# EAGLE design motor4 (EAGLE 6.1)

## Sheet 1 of 3
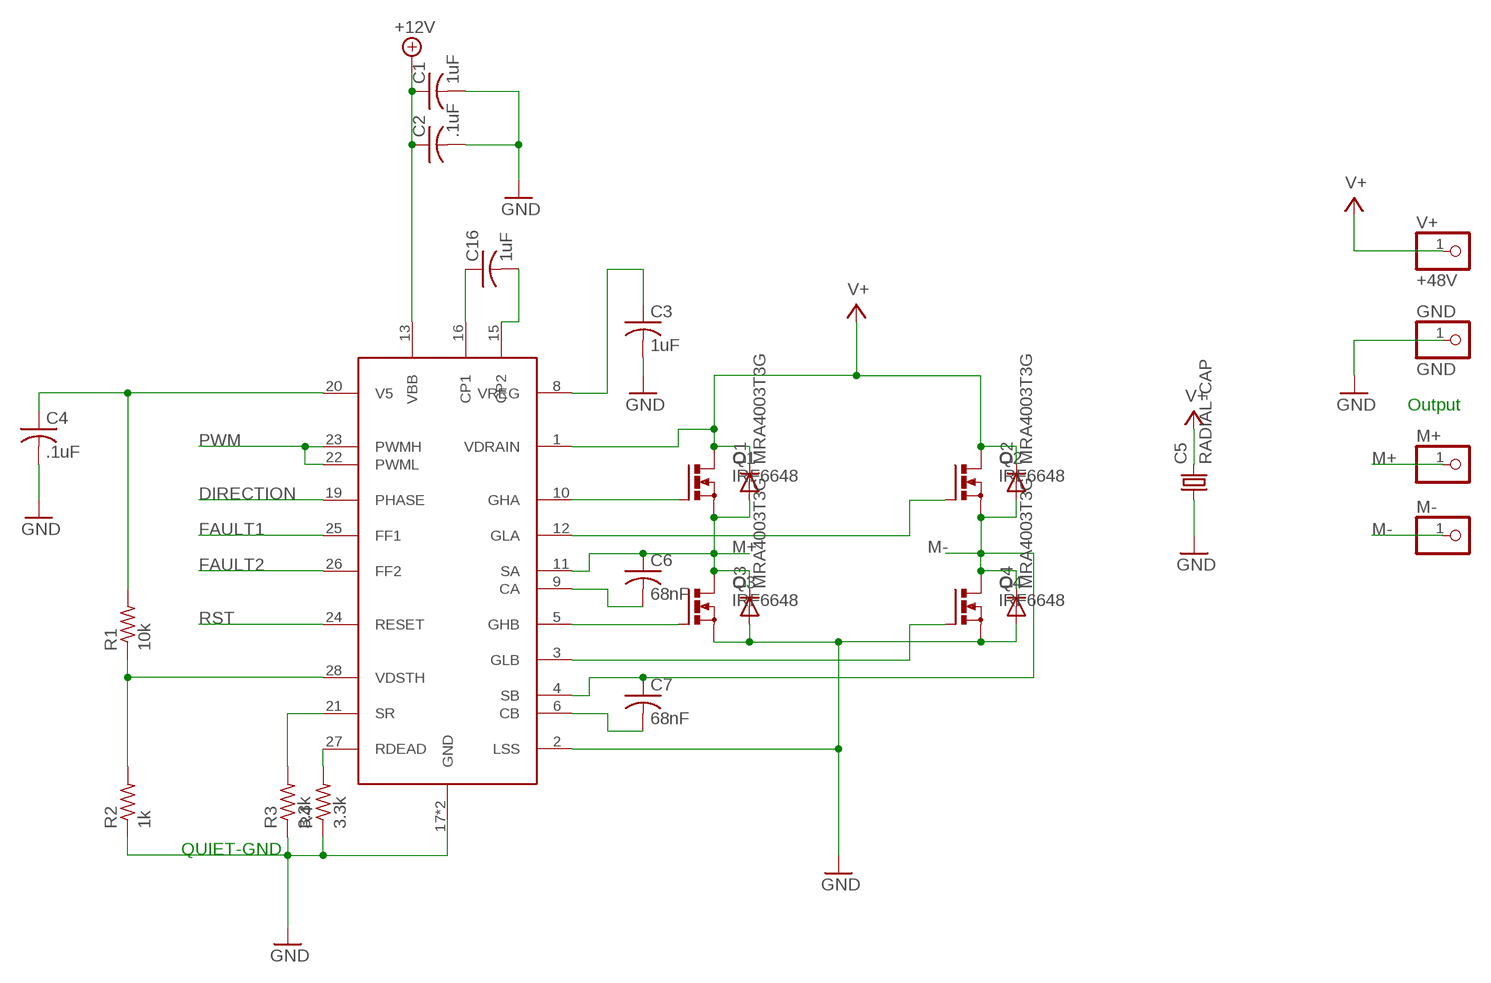
[diagram p0: schematic, sheet 1]

### Parts
ALLGR  ALLEGRO-A3921  [TSSOP28]
C1  1uF  C-USC0603  [C0603]
C2  .1uF  C-USC0603  [C0603]
C3  1uF  C-USC0603  [C0603]
C4  .1uF  C-USC0603  [C0603]
C5  RADIAL-CAP  [RADIAL-CAP]
C6  68nF  C-USC0603  [C0603]
C7  68nF  C-USC0603  [C0603]
C16  1uF  C-USC0603  [C0603]
D1  MRA4003T3G  [SMA]
D2  MRA4003T3G  [SMA]
D3  MRA4003T3G  [SMA]
D4  MRA4003T3G  [SMA]
GND  GND  PINHD-1X1  [1X01]
M+  PINHD-1X1  [1X01]
M-  PINHD-1X1  [1X01]
Q1  IRF6648  [DIRECTFET]
Q2  IRF6648  [DIRECTFET]
Q3  IRF6648  [DIRECTFET]
Q4  IRF6648  [DIRECTFET]
R1  10k  R-US_R0603  [R0603]
R2  1k  R-US_R0603  [R0603]
R3  3.3k  R-US_R0603  [R0603]
R4  3.3k  R-US_R0603  [R0603]
V+  +48V  PINHD-1X1  [1X01]

### Nets
+5V-A: ALLGR.20(V5) C4.1 R1.2
+12V: ALLGR.13(VBB) C1.1 C2.1 ; also sheet 3
+48V: ALLGR.1(VDRAIN) C5.P$1 D1.C D2.C Q1.D@1(D) Q1.D@2(D) Q1.D@3(D) Q1.D@4(D) Q2.D@1(D) Q2.D@2(D) Q2.D@3(D) Q2.D@4(D) V+.1 ; supply symbol labelled V+ ; also sheet 3
DIRECTION: ALLGR.19(PHASE) ; also sheet 2
FAULT1: ALLGR.25(FF1) ; also sheet 2
FAULT2: ALLGR.26(FF2) ; also sheet 2
GND: ALLGR.2(LSS) ALLGR.17(GND) ALLGR.P$1(GND) C1.2 C2.2 C3.2 C4.2 C5.P$2 D3.A D4.A GND.1 Q3.S@1(S) Q3.S@2(S) Q4.S@1(S) Q4.S@2(S) R2.1 R3.1 R4.1 ; also sheet 2,3
M+: ALLGR.11(SA) C6.1 D1.A D3.C M+.1 Q1.S@1(S) Q1.S@2(S) Q3.D@1(D) Q3.D@2(D) Q3.D@3(D) Q3.D@4(D)
M-: ALLGR.4(SB) C7.1 D2.A D4.C M-.1 Q2.S@1(S) Q2.S@2(S) Q4.D@1(D) Q4.D@2(D) Q4.D@3(D) Q4.D@4(D)
N$1: ALLGR.8(VREG) C3.1
N$2: ALLGR.16(CP1) C16.1
N$3: ALLGR.15(CP2) C16.2
N$4: ALLGR.10(GHA) Q1.G
N$6: ALLGR.12(GLA) Q2.G
N$7: ALLGR.3(GLB) Q4.G
N$11: ALLGR.6(CB) C7.2
N$12: ALLGR.9(CA) C6.2
N$13: ALLGR.28(VDSTH) R1.1 R2.2
N$20: ALLGR.27(RDEAD) R4.2
N$21: ALLGR.5(GHB) Q3.G
N$23: ALLGR.21(SR) R3.2
PWM: ALLGR.22(PWML) ALLGR.23(PWMH) ; also sheet 2
RST: ALLGR.24(RESET) ; also sheet 2

### Notes on the sheet
- Output
- QUIET-GND

## Sheet 2 of 3
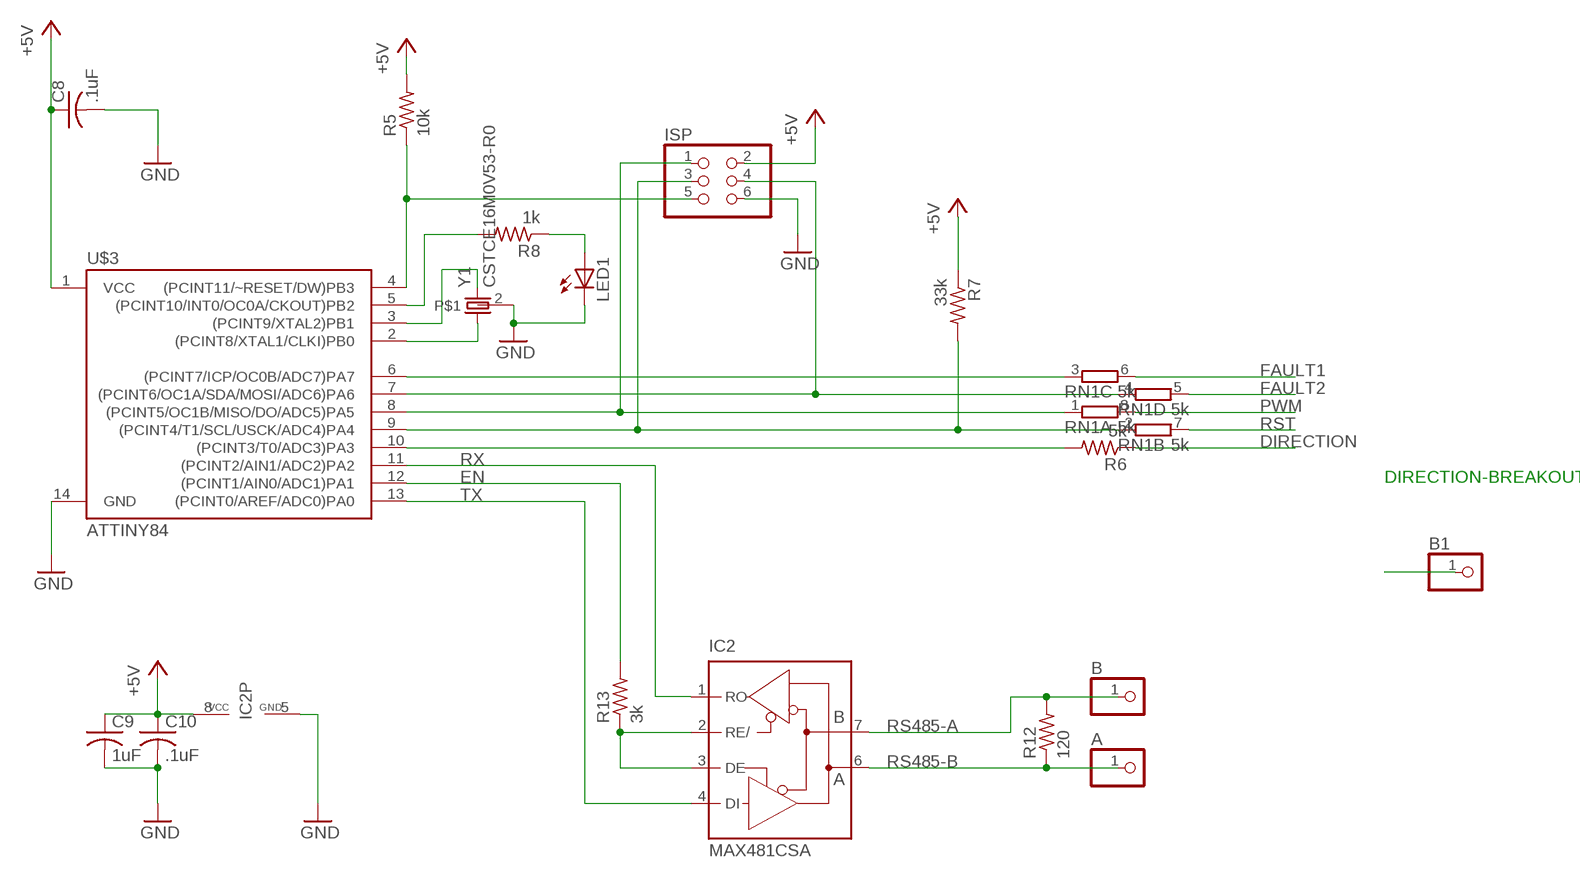
[diagram p1: schematic, sheet 2]

### Parts
A  PINHD-1X1  [1X01]
B  PINHD-1X1  [1X01]
B1  PINHD-1X1  [1X01]
C8  .1uF  C-USC0603  [C0603]
C9  1uF  C-USC0603  [C0603]
C10  .1uF  C-USC0603  [C0603]
IC2  MAX481CSA  [SO08]
ISP  PINHD-2X3  [2X03]
LED1  LEDCHIPLED_0603  [CHIPLED_0603]
R5  10k  R-US_R0603  [R0603]
R6  5k  R-US_R0603  [R0603]
R7  33k  R-US_R0603  [R0603]
R8  1k  R-US_R0603  [R0603]
R12  120  R-US_R0603  [R0603]
R13  3k  R-US_R0603  [R0603]
RN1  5k  4R-NEXB38V  [EXB38V]
U$3  ATTINY84  [SO14]
Y1  CSTCE16M0V53-R0  [MYSMD2_RESONATOR]

### Nets
+5V: C8.1 C9.1 C10.1 IC2.8(VCC) ISP.2 R5.2 R7.1 U$3.1(VCC) ; also sheet 3
DIRECTION: R6.1 ; also sheet 1
EN: R13.2 U$3.12((PCINT1/AIN0/ADC1)PA1)
FAULT1: RN1.6 ; also sheet 1
FAULT2: RN1.5 ; also sheet 1
GND: C8.2 C9.2 C10.2 IC2.5(GND) ISP.6 LED1.C U$3.14(GND) Y1.2 ; also sheet 1,3
N$5: ISP.1 RN1.1 U$3.8((PCINT5/OC1B/MISO/DO/ADC5)PA5)
N$8: ISP.4 RN1.4 U$3.7((PCINT6/OC1A/SDA/MOSI/ADC6)PA6)
N$9: ISP.5 R5.1 U$3.4((PCINT11/~RESET/DW)PB3)
N$14: IC2.2(RE/) IC2.3(DE) R13.1
N$16: U$3.2((PCINT8/XTAL1/CLKI)PB0) Y1.1
N$18: RN1.3 U$3.6((PCINT7/ICP/OC0B/ADC7)PA7)
N$19: B1.1 R6.2 U$3.10((PCINT3/T0/ADC3)PA3)
N$24: U$3.3((PCINT9/XTAL2)PB1) Y1.3
N$26: LED1.A R8.1
N$28: R8.2 U$3.5((PCINT10/INT0/OC0A/CKOUT)PB2)
OIJWOIJ3: ISP.3 R7.2 RN1.2 U$3.9((PCINT4/T1/SCL/USCK/ADC4)PA4)
PWM: RN1.8 ; also sheet 1
RS485-A: B.1 IC2.7(B) R12.2
RS485-B: A.1 IC2.6(A) R12.1
RST: RN1.7 ; also sheet 1
RX: IC2.1(RO) U$3.11((PCINT2/AIN1/ADC2)PA2)
TX: IC2.4(DI) U$3.13((PCINT0/AREF/ADC0)PA0)

### Notes on the sheet
- DIRECTION-BREAKOUT

## Sheet 3 of 3
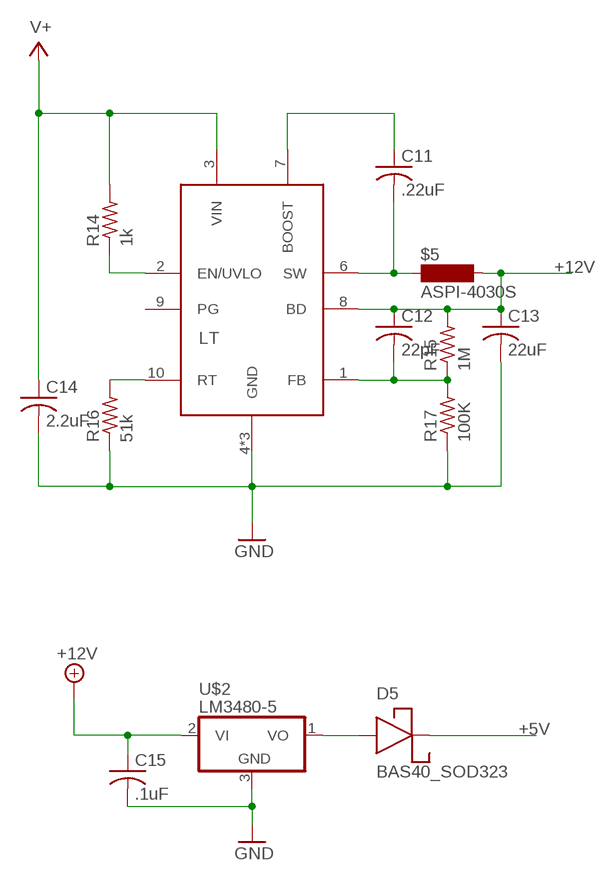
[diagram p2: schematic, sheet 3]

### Parts
$5  ASPI-4030S  [ASPI-4030S]
C11  .22uF  C-USC0603  [C0603]
C12  22pF  C-USC0603  [C0603]
C13  22uF  C-USC0805  [C0805]
C14  2.2uF  C-USC0603  [C0603]
C15  .1uF  C-USC0603  [C0603]
D5  BAS40_SOD323  [SOD323]
LT  LT3990  [DFN10-3X3]
R14  1k  R-US_R0603  [R0603]
R15  1M  R-US_R0603  [R0603]
R16  51k  R-US_R0603  [R0603]
R17  100K  R-US_R0603  [R0603]
U$2  LM3480-5  [SOT23]

### Nets
+5V: D5.1 ; also sheet 2
+12V: $5.P$2 C12.1 C13.1 C15.1 LT.8(BD) R15.2 U$2.2(VI) ; also sheet 1
+48V: C14.1 LT.3(VIN) R14.2 ; supply symbol labelled V+ ; also sheet 1
GND: C13.2 C14.2 C15.2 LT.4(GND) LT.5(GND) LT.EXP(GND) R16.1 R17.1 U$2.3(GND) ; also sheet 1,2
N$10: C11.1 LT.7(BOOST)
N$15: $5.P$1 C11.2 LT.6(SW)
N$17: C12.2 LT.1(FB) R15.1 R17.2
N$22: LT.10(RT) R16.2
N$25: D5.2 U$2.1(VO)
N$27: LT.2(EN/UVLO) R14.1
Unconnected: LT.9(PG)

## Library data of the parts
$5 = evan:ASPI-4030S
A B B1 GND M+ M- V+ = pinhead:PINHD-1X1: PIN HEADER
ALLGR = evan:ALLEGRO-A3921: Allegro A3921 Automotive Full Bridge Mosfet Driver
C1-C4 C6-C16 = rcl:C-US: CAPACITOR, American symbol
C5 = evan:RADIAL-CAP
D1-D4 = evan:MRA4003T3G
D5 = evan:BAS40_SOD323
IC2 = maxim:MAX481CSA: RS485 TRANSEIVER; MF: MAXIM; MPN: MAX481CSA; OC_FARNELL: unknown; OC_NEWARK: 90C3817
ISP = pinhead:PINHD-2X3: PIN HEADER
LED1 = led:LED: LED OSRAM: - CHIPLED LG R971, LG N971, LY N971, LG Q971, LY Q971, LO R971, LY R971 LH N974, LH R974 LS Q976, LO Q976, LY Q976 LO Q996 - Hyper CHIPLED LW Q18S LB Q993, LB Q99A, LB R99A - SideLED LS A670, LO A670, LY A670, LG A670, LP A670 LB A673, LV A673, LT A673, LW A673 LH A674 LY A675 LS A676, LA A676, LO A676, LY A676, LW A676 LS A679, LY A679, LG A679 - Hyper Micro SIDELED® LS Y876, LA Y876, LO Y876, LY Y876 LT Y87S - SmartLED LW L88C, LW L88S LB L89C, LB L89S, LG L890 LS L89K, LO L89K, LY L89K LS L896, LA L896, LO L896, LY L896 - TOPLED LS T670, LO T670, LY T670, LG T670, LP T670 LSG T670, LSP T670, LSY T670, LOP T670, LYG T670 LG T671, LOG T671, LSG T671 LB T673, LV T673, LT T673, LW T673 LH T674 LS T676, LA T676, LO T676, LY T676, LB T676, LH T676, LSB T676, LW T676 LB T67C, LV T67C, LT T67C, LS T67K, LO T67K, LY T67K, LW E67C LS E67B, LA E67B, LO E67B, LY E67B, LB E67C, LV E67C, LT E67C LW T67C LS T679, LY T679, LG T679 LS T770, LO T770, LY T770, LG T770, LP T770 LB T773, LV T773, LT T773, LW T773 LH T774 LS E675, LA E675, LY E675, LS T675 LS T776, LA T776, LO T776, LY T776, LB T776 LHGB T686 LT T68C, LB T68C - Hyper Mini TOPLED® LB M676 - Mini TOPLED Santana® LG M470 LS M47K, LO M47K, LY M47K Source: http://www.osram.convergy.de LUXEON: - LUMILED® LXK2-PW12-R00, LXK2-PW12-S00, LXK2-PW14-U00, LXK2-PW14-V00 LXK2-PM12-R00, LXK2-PM12-S00, LXK2-PM14-U00 LXK2-PE12-Q00, LXK2-PE12-R00, LXK2-PE12-S00, LXK2-PE14-T00, LXK2-PE14-U00 LXK2-PB12-K00, LXK2-PB12-L00, LXK2-PB12-M00, LXK2-PB14-N00, LXK2-PB14-P00, LXK2-PB14-Q00 LXK2-PR12-L00, LXK2-PR12-M00, LXK2-PR14-Q00, LXK2-PR14-R00 LXK2-PD12-Q00, LXK2-PD12-R00, LXK2-PD12-S00 LXK2-PH12-R00, LXK2-PH12-S00 LXK2-PL12-P00, LXK2-PL12-Q00, LXK2-PL12-R00 Source: www.luxeon.com KINGBRIGHT: KA-3528ASYC Source: www.kingbright.com
LT = evan:LT3990: http://cds.linear.com/docs/en/datasheet/3990fa.pdf
Q1-Q4 = transistor-power:IRF6648: DirectFET Power MOSFET Source: http://www.irf.com/product-info/datasheets/data/irf6648.pdf
R1-R8 R12-R17 = rcl:R-US_: RESISTOR, American symbol
RN1 = resistor-dil:4R-N: Array Chip Resistor Source: RS Component / Phycomp; OC_FARNELL: unknown; OC_NEWARK: unknown
U$2 = evan:LM3480-5
U$3 = evan:ATTINY84: Atmel 14-pin 2/4/8kB flash uC
Y1 = evan:CSTCE16M0V53-R0

## Board
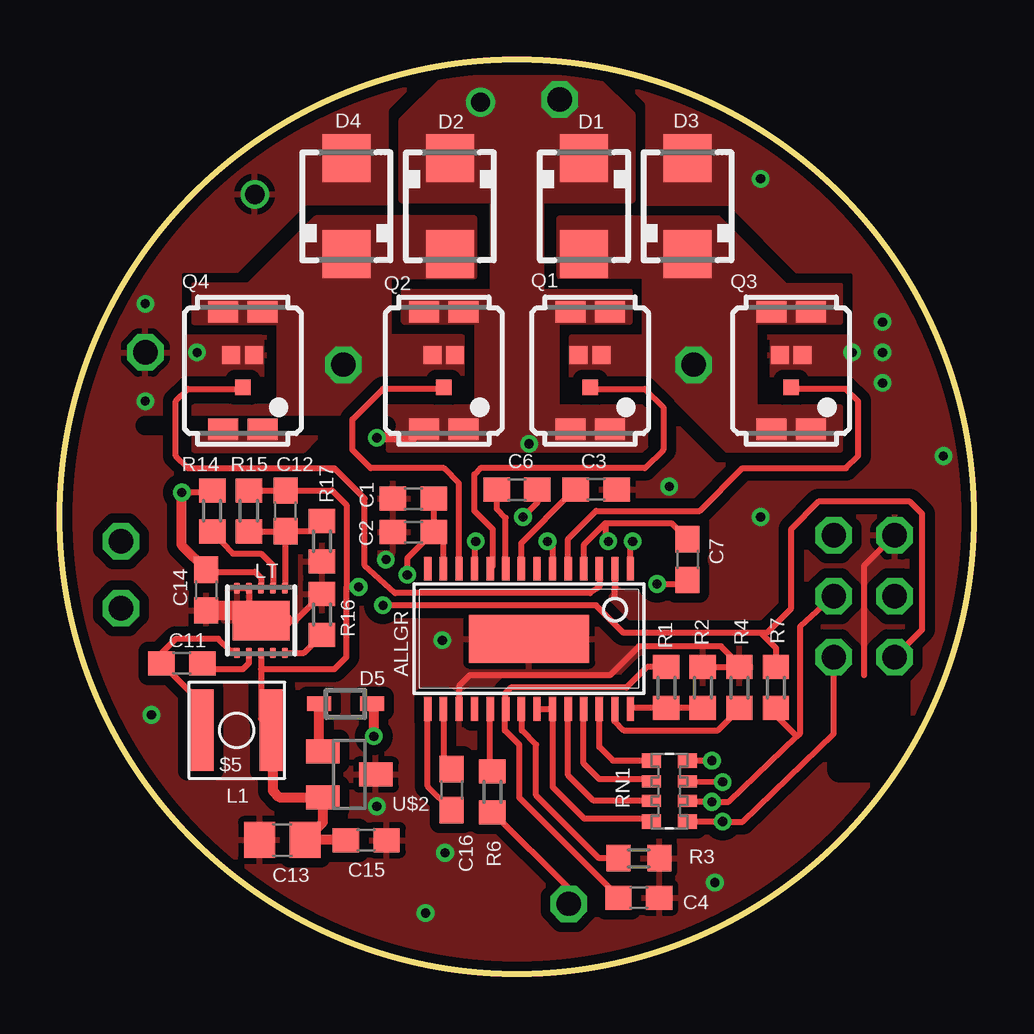
[diagram p3: board, top side]
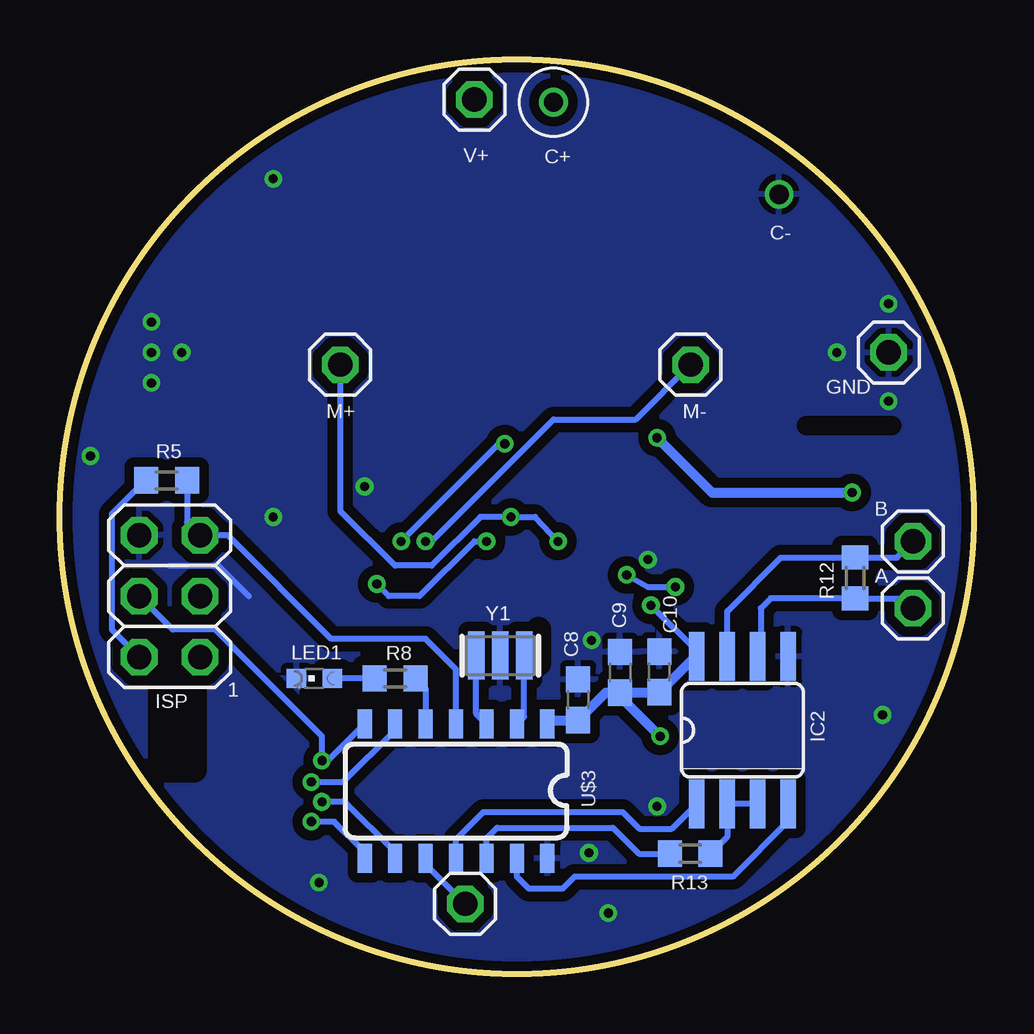
[diagram p4: board, bottom side, seen from below]

Size 38.1 x 38.1 mm. Coordinates in mm from the lower left corner, seen from the top.
Outline: circle at 19.05,19.05 radius 19.05
Copper layers (1*16): Top 0.0356mm / dielectric 1.5011mm / Bottom 0.0356mm
Design rules: minimum track width 6mil, minimum drill 13mil, track to track 6mil, track to pad 6mil, pad to pad 6mil, via to via 6mil, smd to smd 6mil, copper to edge 15mil, drill to drill 6mil, minimum pad ring 7mil, minimum via ring 7mil, stop-mask expansion 3mil, vias tented up to drill 0mil, thermal gap 10mil
tRestrict: area 32.5,8.5 to 34.9,12.2; 1 lines
bRestrict: area 32.5,8.5 to 33.9,12.2; 5 lines

### Footprints (pad centres in the part's own frame; a part is rotated, then mirrored left to right if it is on the bottom)
ASPI-4030S = smd 1.1 x 3.4: P$1 -1.5,0; P$2 1.5,0
1X01 = drill 1.016 octagon: 1 0,0
TSSOP28 = smd 0.305 x 0.991: 1 -4.225,-2.918; 2 -3.575,-2.918; 3 -2.925,-2.918; 4 -2.275,-2.918; 5 -1.625,-2.918; 6 -0.975,-2.918; 7 -0.325,-2.918; 8 0.325,-2.918; 9 0.975,-2.918; 10 1.625,-2.918; 11 2.275,-2.918; 12 2.925,-2.918; 13 3.575,-2.918; 14 4.225,-2.918; 15 4.225,2.918; 16 3.575,2.918; 17 2.925,2.918; 18 2.275,2.918; 19 1.625,2.918; 20 0.975,2.918; 21 0.325,2.918; 22 -0.325,2.918; 23 -0.975,2.918; 24 -1.625,2.918; 25 -2.275,2.918; 26 -2.925,2.918; 27 -3.575,2.918; 28 -4.225,2.918 | smd 5 x 2: P$1 0,0
C0603 = smd 1.1 x 1: 1 -0.85,0; 2 0.85,0
RADIAL-CAP = drill 0.8: P$1 -5.08,0; P$2 5.08,0
C0805 = smd 1.3 x 1.5: 1 -0.95,0; 2 0.95,0
SMA = smd 2 x 2: A 2,0; C -2,0
SOD323 = smd 1 x 0.6: 1 -1.1,0; 2 1.1,0
SO08 = smd 0.66 x 2.032: 1 -1.905,-3.073; 2 -0.635,-3.073; 3 0.635,-3.073; 4 1.905,-3.073; 5 1.905,3.073; 6 0.635,3.073; 7 -0.635,3.073; 8 -1.905,3.073
2X03 = drill 1.016 octagon: 1 -2.54,-1.27; 2 -2.54,1.27; 3 0,-1.27; 4 0,1.27; 5 2.54,-1.27; 6 2.54,1.27
CHIPLED_0603 = smd 0.8 x 0.8: A 0,-0.75; C 0,0.75
DFN10-3X3 = smd 0.25 x 0.45: 1 -1,-1.35; 2 -0.5,-1.35; 3 0,-1.35; 4 0.5,-1.35; 5 1,-1.35; 6 1,1.35; 7 0.5,1.35; 8 0,1.35; 9 -0.5,1.35; 10 -1,1.35 | smd 2.38 x 1.65: EXP 0,0
DIRECTFET = smd 0.9 x 1.25: D@1 -2.45,0.825; D@2 -2.45,-0.825; D@3 2.45,0.825; D@4 2.45,-0.825 | smd 0.65 x 0.65: G -0.7,0 | smd 0.75 x 0.75: S@1 0.65,0.475; S@2 0.65,-0.475
R0603 = smd 1 x 1.1: 1 -0.85,0; 2 0.85,0
EXB38V = smd 0.6 x 0.8: 1 -1.275,-0.75; 4 1.275,-0.75; 5 1.275,0.75; 8 -1.275,0.75 | smd 0.5 x 0.8: 2 -0.4,-0.75; 3 0.4,-0.75; 6 0.4,0.75; 7 -0.4,0.75
SOT23 = smd 1 x 1.4: 1 -0.95,-1.1; 2 0.95,-1.1; 3 0,1.1
SO14 = smd 0.6 x 1.2: 1 -3.81,-2.8; 2 -2.54,-2.8; 3 -1.27,-2.8; 4 0,-2.8; 5 1.27,-2.8; 6 2.54,-2.8; 7 3.81,-2.8; 8 3.81,2.8; 9 2.54,2.8; 10 1.27,2.8; 11 0,2.8; 12 -1.27,2.8; 13 -2.54,2.8; 14 -3.81,2.8
MYSMD2_RESONATOR = smd 0.7 x 2: 1 -1,0; 2 0,0; 3 1,0

### Placement (x,y rotation side)
$5  7.37,10.16 0 top
A  2.54,15.24 0 bottom
ALLGR  19.56,13.97 180 top
B  2.54,18.03 0 bottom
B1  21.21,2.92 0 bottom
C1  14.73,19.81 180 top
C2  14.73,18.41 180 top
C3  22.35,20.19 0 top
C4  24.13,3.18 0 top
C5  12.83,34.42 337.8 bottom
C6  19.05,20.19 180 top
C7  26.16,17.27 270 top
C8  16.5,11.43 90 bottom
C9  14.75,12.57 90 bottom
C10  13.11,12.59 90 bottom
C11  5.08,12.95 180 top
C12  9.4,19.3 270 top
C13  9.27,5.58 180 top
C14  6.1,16 270 top
C15  12.76,5.57 0 top
C16  16.32,7.68 270 top
D1  21.84,32 270 top
D2  16.26,32 270 top
D3  26.16,32 90 top
D4  11.94,32 90 top
D5  11.9,11.26 180 top
GND  3.56,25.91 0 bottom
IC2  9.65,10.16 0 bottom
ISP  33.53,15.75 90 bottom
LED1  27.5,12.32 90 bottom
LT  8.38,14.73 180 top
M+  26.42,25.4 0 bottom
M-  11.81,25.4 0 bottom
Q1  22.1,25.15 90 top
Q2  16,25.15 90 top
Q3  30.48,25.15 90 top
Q4  7.62,25.15 90 top
R1  25.27,11.94 90 top
R2  26.8,11.94 270 top
R3  24.13,4.83 180 top
R4  28.32,11.94 270 top
R5  33.66,20.57 180 bottom
R6  18.03,7.59 270 top
R7  29.84,11.94 270 top
R8  24.13,12.32 0 bottom
R12  4.95,16.51 90 bottom
R13  11.83,5.02 180 bottom
R14  6.35,19.3 90 top
R15  7.87,19.3 90 top
R16  10.92,14.99 270 top
R17  10.92,18.03 90 top
RN1  25.4,7.62 90 top
U$2  12.06,8.32 270 top
U$3  21.59,7.62 180 bottom
V+  20.83,36.45 0 bottom
Y1  19.75,13.27 180 bottom

### Tracks (layer width: path | path; a pad name or v marks a point on that pad's centre or on a via)
+5V  (via drill 0.38, 0.38 pad 0.25)
  Top 0.254: ISP.2 35.94,14.35 35.94,19.18 35.43,19.69 31.62,19.69 30.48,18.54 30.48,15.24 29.46,14.22 29.21,14.22 | 29.21,14.22 23.5,14.22 22.35,15.37 v13.46,15.37 | 29.21,14.22 29.84,13.59 R7.1
  Top 0.406: D5.1 13.08,10.93 v13.08,9.91
  Bottom 0.254: R5.2 34.54,20.57 35.94,19.18 35.94,14.35 ISP.2 | v13.46,15.37 11.56,13.46 IC2.8
  Bottom 0.406: U$3.1 17.62,10.58 C8.1 15.35,11.72 14.9,11.72 | 14.9,11.72 C9.1 13.13,11.72 C10.1 11.62,13.23 IC2.8 | v13.08,9.91 14.9,11.72
+5V-A
  Top 0.254: R1.2 24.47,12.79 23.62,11.94 18.8,11.94 18.54,11.68 18.54,11.09 ALLGR.20 18.55,11.02 18.55,10.15 19.15,9.55 19.15,7.35 23.28,3.22 C4.1
+12V  (via drill 0.38 pad 0.25)
  Top 0.254: C1.1 C2.1 | ALLGR.13 15.98,18.01 C2.1 | LT.8 8.38,12.7 | 8.38,12.7 8.38,10.64 $5.P$2 | 11.94,16.13 11.94,19.56 11.34,20.15 C12.1 R15.2 | 8.38,12.7 11.43,12.7 11.94,13.21 11.94,16.13 | C2.1 14.48,17.31 v14.48,16.64 | v12.45,16.13 11.94,16.13
  Top 0.406: $5.P$2 8.87,7.64 9.14,7.37 U$2.2 10.96,6.32 C13.1 C15.1
  Bottom 0.254: v14.48,16.64 13.59,16.13 v12.45,16.13
+48V  (via drill 0.38 pad 0.25)
  Top 0.254: C14.1 6.18,16.76 8.13,16.76 8.38,16.51 LT.3 | Q2.D@1 14.71,22.35 | ALLGR.1 23.78,17.94 v23.88,18.03 | R14.2 6.26,20.07 v5.08,20.07
  Top 0.406: 14.71,22.35 v13.21,22.35 | v5.08,20.07 5.08,17.87 C14.1
  Bottom 0.254: v23.88,18.03 19.81,22.1 v19.56,22.1
  Bottom 0.406: v13.21,22.35 10.92,20.07 v5.08,20.07
  pour Top (isolate 0.406, rank 2, no thermals): 22.35,37.34 16,37.34 14.22,35.56 14.22,32.26 18.03,32.26 18.03,28.19 20.07,28.19 20.07,32.26 23.88,32.26 23.88,35.81
  pour Top (isolate 0.406, rank 2, no thermals): 20.7,23.62 24.38,23.62 24.38,21.84 13.72,21.84 13.72,23.62 17.4,23.62 17.4,27.18 14.35,27.18 14.35,28.45 23.75,28.45 23.75,27.18 20.7,27.18
DIRECTION
  Top 0.254: R6.1 17.93,8.62 ALLGR.19
EN
  Bottom 0.254: U$3.12 20.32,5.65 19.88,6.1 15.05,6.1 13.97,5.02 R13.2
FAULT1
  Top 0.254: ALLGR.25 21.83,8.77 22.48,8.13 24.54,8.13 RN1.6
FAULT2
  Top 0.254: ALLGR.26 22.48,9.46 23.05,8.9 RN1.5
GND  (via drill 0.38, 0.38 pad 0.25)
  Top 0.254: 33.53,12.45 33.53,17.02 34.92,18.41 | 23.11,16 23.13,16.02 ALLGR.2 23.11,16.87 23.11,15.75 | LT.5 LT.4 7.88,15.23 7.96,15.15 | 9.4,14.73 9.82,14.73 R16.1 | R2.1 R4.1 28.32,12.89 27.56,13.65 24.13,13.65 22.92,12.45 17.08,12.45 16.64,12 ALLGR.17
  Top 0.61: LT.EXP 9.4,14.73
  Top 0.813: C14.2 7.96,15.15 LT.EXP
  Bottom 0.254: 33.53,17.02 31.5,17.02 30.23,15.75
  other vias: 3.81,10.79 29.21,19.05 27.3,3.81 13.59,17.27 25.4,20.32 29.21,33.15 33.02,25.91 36.83,21.59 15.94,13.91 34.29,27.18 34.29,24.64 3.56,27.94 3.56,23.88 34.29,25.91 5.71,25.91 16.05,5.05 15.24,2.54 13.21,6.99
  pour Top (isolate 0.406, rank 2, no thermals): 4.83,26.54 8.38,26.54 8.38,24.89 4.83,24.89
  pour Top (isolate 0.406, rank 3): 19.05,38.1 arc90 0,19.05 arc90 19.05,0 arc90 38.1,19.05 arc90
  pour Bottom (isolate 0.406): 19.05,38.1 arc90 0,19.05 arc90 19.05,0 arc90 38.1,19.05 arc90
  pour Top (isolate 0.406, rank 2, no thermals): 29.72,26.54 33.27,26.54 33.27,24.89 29.72,24.89
  pour Top (no thermals): 27.81,32.77 24.77,32.77 24.77,35.43 27.81,35.43
  pour Top (no thermals): 13.33,32.77 10.29,32.77 10.29,35.43 13.33,35.43
M+  (via drill 0.38 pad 0.25)
  Top 0.254: C6.1 19.9,19.65 v19.3,19.05 | ALLGR.11 17.28,17.98 v17.34,18.03
  Bottom 0.254: v17.34,18.03 18.29,19.05 v19.3,19.05 20.57,19.05 22.61,17.02 24.13,17.02 26.42,19.3 M+.1
  pour Top (isolate 0.406, rank 2, no thermals): 32.51,21.84 27.81,21.84 24.77,24.89 21.34,24.89 21.34,26.54 24.38,26.54 24.38,29.08 20.83,29.08 20.83,31.5 27.43,31.5 30.23,28.7 32.51,28.7 32.51,27.18 28.96,27.18 28.96,23.62 32.51,23.62
M-  (via drill 0.38 pad 0.25)
  Top 0.254: ALLGR.4 21.84,16.9 21.84,17.91 22.73,18.8 | 22.73,18.8 25.49,18.8 C7.1 | 22.73,18.8 22.73,18.16 v22.86,18.03
  Bottom 0.254: v22.86,18.03 22.61,18.03 17.53,23.11 14.1,23.11 M-.1
  pour Top (isolate 0.406, rank 2, no thermals): 5.59,21.84 10.16,21.84 13.08,24.89 16.76,24.89 16.76,26.54 13.72,26.54 13.72,29.08 17.27,29.08 17.27,31.5 10.67,31.5 7.87,28.7 5.59,28.7 5.59,27.18 9.14,27.18 9.14,23.62 5.59,23.62
N$1
  Top 0.254: ALLGR.8 19.23,17.96 21.25,19.98 C3.1
N$2
  Top 0.254: ALLGR.16 15.98,8.87 C16.1
N$3
  Top 0.254: C16.2 15.33,7.82 ALLGR.15
N$4
  Top 0.254: ALLGR.10 18.03,16.99 18.03,18.54 17.27,19.3 17.27,20.83 17.53,21.08 24.38,21.08 25.15,21.84 25.15,23.62 24.38,24.38 22.16,24.38 Q1.G
N$5  (via drill 0.38)
  Top 0.254: RN1.1 v27.62,6.35 v27.63,6.35 28.46,6.35 32.26,10.02 ISP.1
  Bottom 0.254: U$3.8 25.4,5.08 26.67,6.35 v27.62,6.35
N$6
  Top 0.254: ALLGR.12 16.63,20.45 16,21.08 12.95,21.08 12.19,21.84 12.19,23.11 13.46,24.38 15.94,24.38 Q2.G 15.81,24.64
N$7
  Top 0.203: 7.43,24.38 Q4.G
  Top 0.254: ALLGR.3 22.48,16.13 22.1,15.88 13.97,15.88 12.7,17.02 12.7,19.81 11.43,21.08 5.33,21.08 4.83,21.59 4.83,23.88 5.33,24.38 7.43,24.38
N$8  (via drill 0.38)
  Top 0.254: RN1.4 v27.17,8.9 v27.18,8.89
  Bottom 0.254: U$3.7 26.93,8.9 26.99,8.9 v27.18,8.89 27.18,9.91 31.62,14.35 33.4,14.35 ISP.4
N$9
  Bottom 0.254: R5.1 32.8,18.84 ISP.5 31.12,18.29 26.8,13.97 22.86,13.97 21.59,12.7 U$3.4
N$10
  Top 0.254: LT.7 7.87,12.95 7.62,12.7 6.35,12.7 6.1,12.95 C11.1
N$11  (via drill 0.38 pad 0.25)
  Top 0.254: v20.32,18.03 20.53,17.82 ALLGR.6 | v24.89,16.26 26,16.26 C7.2
  Bottom 0.254: v20.32,18.03 20.83,18.03 23.11,15.75 24.38,15.75 v24.89,16.26
N$12
  Top 0.254: C6.2 18.2,19.39 18.58,19.01 ALLGR.9
N$13
  Top 0.254: R2.2 R1.1 23.82,11.09 ALLGR.28
N$14
  Bottom 0.254: IC2.3 IC2.2 10.29,5.71 R13.1
N$15
  Top 0.254: LT.6 7.3,13.46 7.11,13.46 6.6,13.97 4.83,13.97 4.23,13.37 C11.2 5.87,11.32 $5.P$1
N$16
  Bottom 0.254: U$3.2 18.75,10.72 Y1.1
N$17
  Top 0.254: R17.2 10.49,18.45 C12.2 | C12.2 9.38,18.44 LT.1 | R15.1 C12.2
N$18  (via drill 0.38)
  Top 0.254: RN1.3 27.44,8 v27.62,8
  Bottom 0.254: 27.64,8.02 v27.62,8 26.29,8 24.13,10.16 U$3.6
N$19
  Top 0.254: R6.2 21.21,3.56 B1.1
  Bottom 0.254: U$3.10 22.86,4.57 B1.1
N$20
  Top 0.254: ALLGR.27 23.11,11.03 23.11,10.54 23.5,10.16 27.43,10.16 28.32,11.05 R4.2
N$21
  Top 0.254: ALLGR.5 21.18,18.14 22.35,19.3 26.67,19.3 28.45,21.08 32.77,21.08 33.27,21.59 33.27,23.88 32.77,24.38 30.54,24.38 Q3.G
N$22
  Top 0.254: LT.10 10.17,13.38 R16.2
N$23
  Top 0.254: R3.2 22.47,4.83 19.85,7.45 19.85,9.55 19.25,10.15 19.25,11.04 ALLGR.21
N$24
  Bottom 0.254: U$3.3 20.75,10.85 Y1.3
N$25
  Top 0.406: U$2.1 10.8,9.43 D5.2
N$26
  Bottom 0.254: R8.1 LED1.A
N$27
  Top 0.254: R14.1 7.21,17.53 8.38,17.53 8.88,17.03 LT.2
N$28
  Bottom 0.254: R8.2 22.86,11.9 U$3.5
OIJWOIJ3  (via drill 0.38)
  Top 0.254: RN1.2 26.19,7.18 v27.18,7.18 27.88,7.18 30.73,9.9 | ISP.3 30.86,14.48 30.86,10.03 30.73,9.9 | R7.2 29.84,10.78 30.73,9.9
  Bottom 0.254: U$3.9 24.13,5.08 26.23,7.18 v27.18,7.18
PWM
  Top 0.254: ALLGR.22 ALLGR.23 20.53,7.79 21.84,6.48 24.52,6.48 RN1.8
RS485-A
  Bottom 0.254: IC2.7 10.29,15.11 8.04,17.36 R12.2 3.21,17.36 B.1
RS485-B
  Bottom 0.254: IC2.6 8.89,13.36 8.89,15.24 8.47,15.66 R12.1 2.96,15.66 A.1
RST
  Top 0.254: ALLGR.24 21.18,8.28 22.23,7.24 24.63,7.24 RN1.7
RX
  Bottom 0.254: U$3.11 21.59,5.61 20.45,6.75 14.65,6.75 13.95,6.05 12.59,6.05 IC2.1
TX
  Bottom 0.254: IC2.4 7.75,6.35 10.05,4.05 16.65,4.05 17.15,3.55 18.55,3.55 19.05,4.05 U$3.13

### Text on the board
tNames: L1
bNames: C+ | C- | 1
_tsilk: Evan Widloski | Purdue IEEE ROV | 2014-11-09 v4